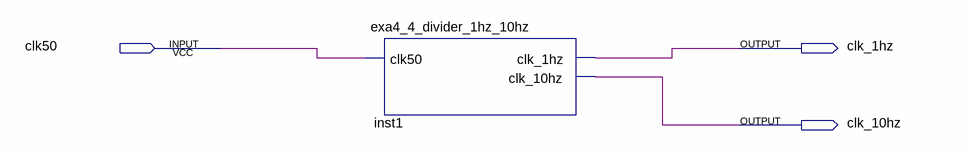
[diagram p0: schematic sheet]
// Quartus schematic experiment_four_task4.bdf as structural Verilog: 1 symbols, 3 pins
module experiment_four_task4 (
  input  clk50,
  output clk_1hz,
  output clk_10hz
);

  exa4_4_divider_1hz_10hz inst1 (.clk50(clk50), .clk_1hz(clk_1hz), .clk_10hz(clk_10hz));
endmodule
